# Altium schematic sheet USB2.0HUB.SchDoc
size A4
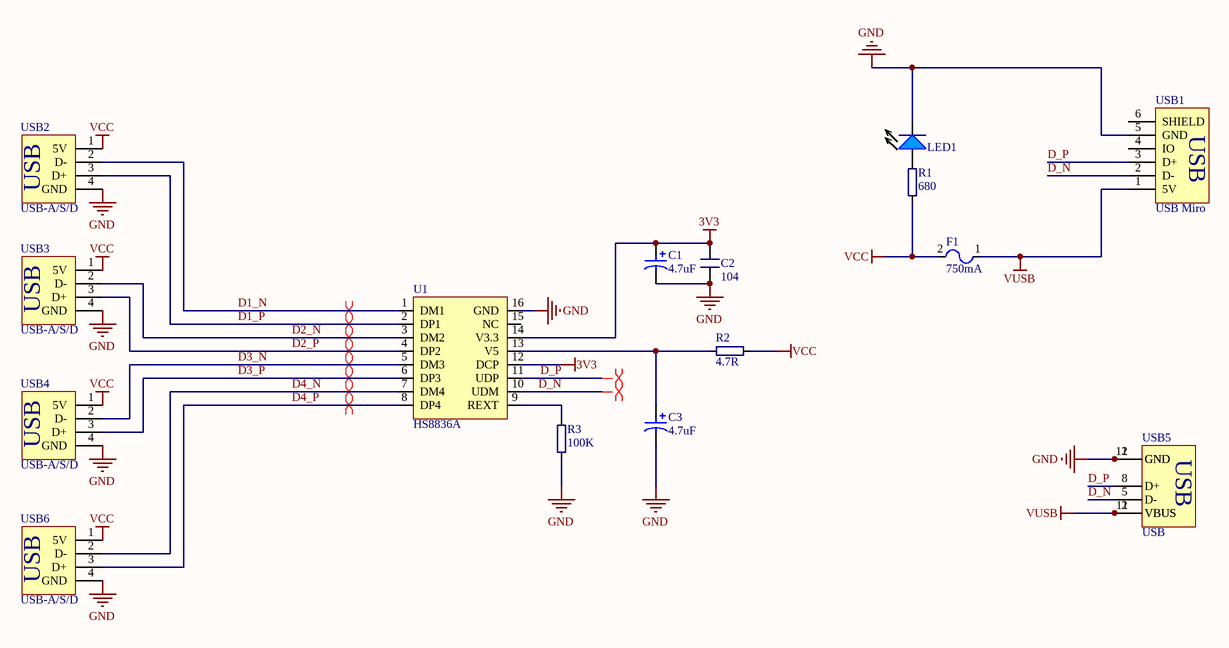
[diagram p0: USB2.0HUB.SchDoc]

## Parts
C1  4.7uF  [SMD-C-AL-4*5.4]
C2  104  [SMD-C-0805]
C3  4.7uF  [SMD-C-AL-4*5.4]
F1  750mA  [SMD-F-0805]
LED1  SMD-LED_Blue  [SMD-LED-0805B]  (value not drawn)
R1  680  [SMD-R-0805]
R2  4.7R  [SMD-R-0805]
R3  100K  [SMD-R-0805]
U1  HS8836A  [SMD-U-SOP-16]
USB1  USB Miro  [USB MICRO]
USB2  USB-A/S/D  [DIP-USB-A/S_D]
USB3  USB-A/S/D  [DIP-USB-A/S_D]
USB4  USB-A/S/D  [DIP-USB-A/S_D]
USB5  USB  [SMD-USB-typeC-12]
USB6  USB-A/S/D  [DIP-USB-A/S_D]

## Nets
3V3: C1.1 C2.2 U1.12(DCP) U1.14(V3.3)
GND: C1.2 C2.1 C3.2 LED1.2 R3.1 U1.16(GND) USB1.5(GND) USB2.4(GND) USB3.4(GND) USB4.4(GND) USB5.1(GND) USB5.12(GND) USB6.4(GND)
VCC: F1.2 R1.2 R2.1 USB2.1(5V) USB3.1(5V) USB4.1(5V) USB6.1(5V)
VUSB: F1.1 USB1.1(5V) USB5.2(VBUS) USB5.11(VBUS)
D1_N: U1.1(DM1) USB2.2(D-)
D1_P: U1.2(DP1) USB2.3(D+)
D2_N: U1.3(DM2) USB3.2(D-)
D2_P: U1.4(DP2) USB3.3(D+)
D3_N: U1.5(DM3) USB4.2(D-)
D3_P: U1.6(DP3) USB4.3(D+)
D4_N: U1.7(DM4) USB6.2(D-)
D4_P: U1.8(DP4) USB6.3(D+)
D_N: U1.10(UDM) USB1.2(D-) USB5.5(D-)
D_P: U1.11(UDP) USB1.3(D+) USB5.8(D+)
NetC3_1: C3.1 R2.2 U1.13(V5)
NetLED1_1: LED1.1 R1.1
NetR3_2: R3.2 U1.9(REXT)

Not connected (* = marked no-connect by the designer): U1 15(NC); USB1 4(IO) 6(SHIELD)

## Layout directives
differential pair: D1_N, D1_P, D2_N, D2_P, D3_N, D3_P, D4_N, D4_P, D_N, D_P

## Notes on the sheet
- (in symbol DIP-USB-A/S_D) USB

## Library data of the parts
C1 C3 = SMD-C-AL-4*5.4
C2 = SMD-C-0805: 贴片瓷片电容; Value: XXpF
F1 = SMD-F-0805: 保险丝贴片自恢复
R1-R3 = SMD-R-0805: Value: ??K
U1 = SMD-IC-HS8836A
USB1 = USB MICRO: USB
USB2-USB4 USB6 = DIP-USB-A/S_D
USB5 = SMD-TYPEC-12